# EAGLE schematic X16-Power-Slab (EAGLE 9.6.2)

## Sheet 1 of 2
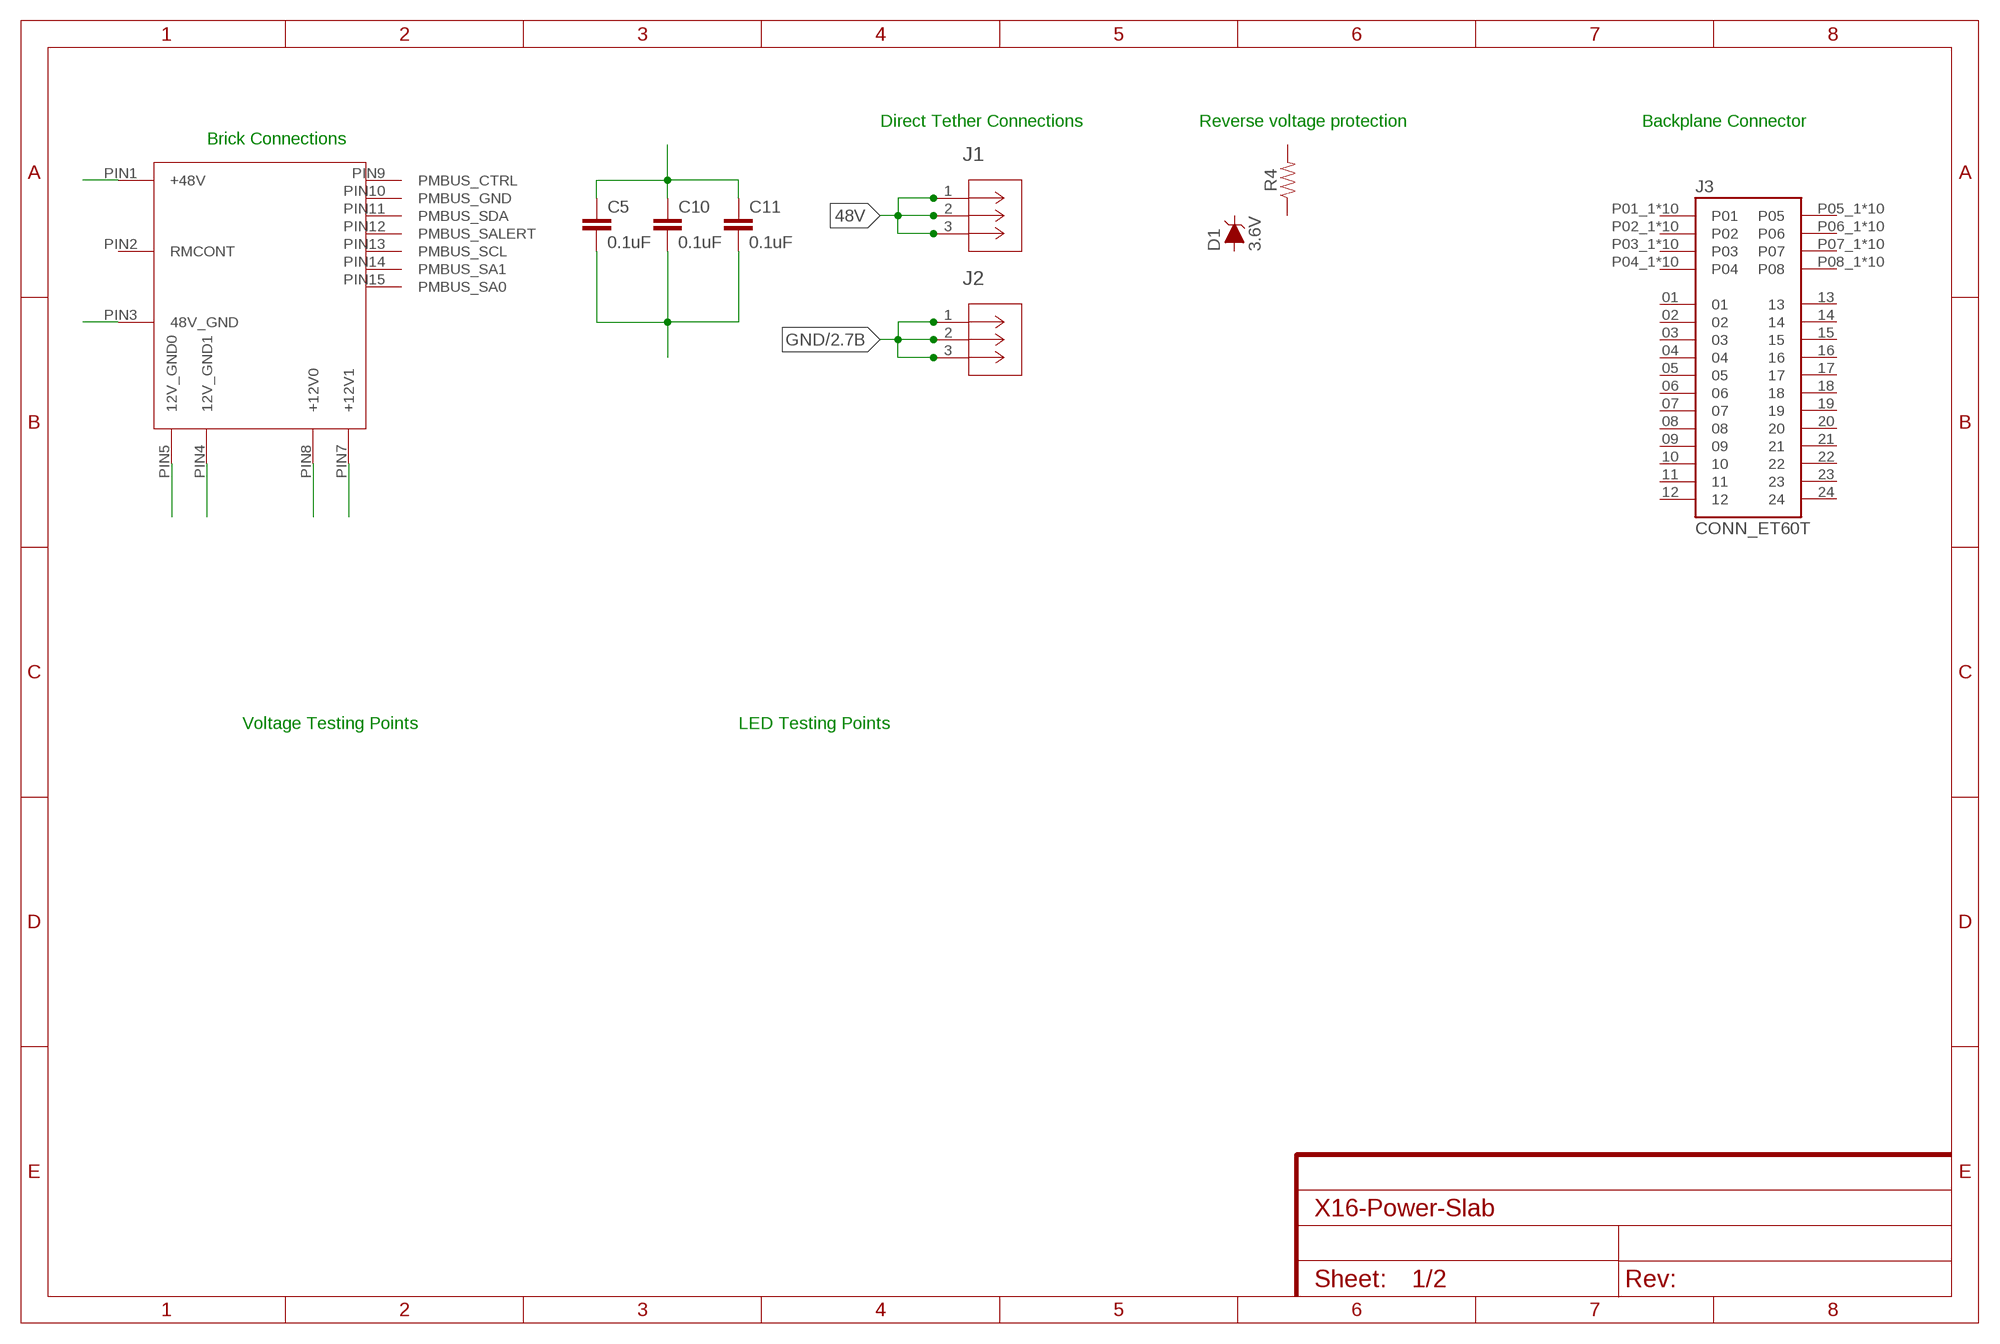
[diagram p0: schematic, sheet 1]

### Parts
C5  0.1uF  0.1UF-0603-25V-(+80/-20%)  [0603]
C10  0.1uF  0.1UF-0603-25V-(+80/-20%)  [0603]
C11  0.1uF  0.1UF-0603-25V-(+80/-20%)  [0603]
D1  3.6V  DIODE-ZENER-BZT52C3V6S  [SOD-323]
J1  CONN_796636-3  [CONN_796636-3]
J2  CONN_796636-3  [CONN_796636-3]
J3  CONN_ET60T  [SAMTEC_ET60T-D04-3-08-D04-X-R1-S]
R4  RESISTOR0603  [0603]
U$1  CONN_BMR480_BRICK  [CONN_BMR480_BRICK]

### Nets
48V: J1.1 J1.2 J1.3
GND: J2.1 J2.2 J2.3 ; also sheet 2
N$10: U$1.PIN5(12V_GND0)
N$11: U$1.PIN4(12V_GND1)
N$12: U$1.PIN8(+12V0)
N$13: U$1.PIN7(+12V1)
N$14: U$1.PIN3(48V_GND)
N$15: U$1.PIN1(+48V)
N$16: C5.1 C10.1 C11.1
N$17: C5.2 C10.2 C11.2
Unconnected: D1.A D1.C J3.01 J3.02 J3.03 J3.04 J3.05 J3.06 J3.07 J3.08 J3.09 J3.10 J3.11 J3.12 J3.13 J3.14 J3.15 J3.16 J3.17 J3.18 J3.19 J3.20 J3.21 J3.22 J3.23 J3.24 R4.1 R4.2 U$1.PIN2(RMCONT) U$1.PIN9(PMBUS_CTRL) U$1.PIN10(PMBUS_GND) U$1.PIN11(PMBUS_SDA) U$1.PIN12(PMBUS_SALERT) U$1.PIN13(PMBUS_SCL) U$1.PIN14(PMBUS_SA1) U$1.PIN15(PMBUS_SA0)

### Notes on the sheet
- Direct Tether Connections | Reverse voltage protection | Backplane Connector
- Brick Connections
- Voltage Testing Points | LED Testing Points

## Sheet 2 of 2
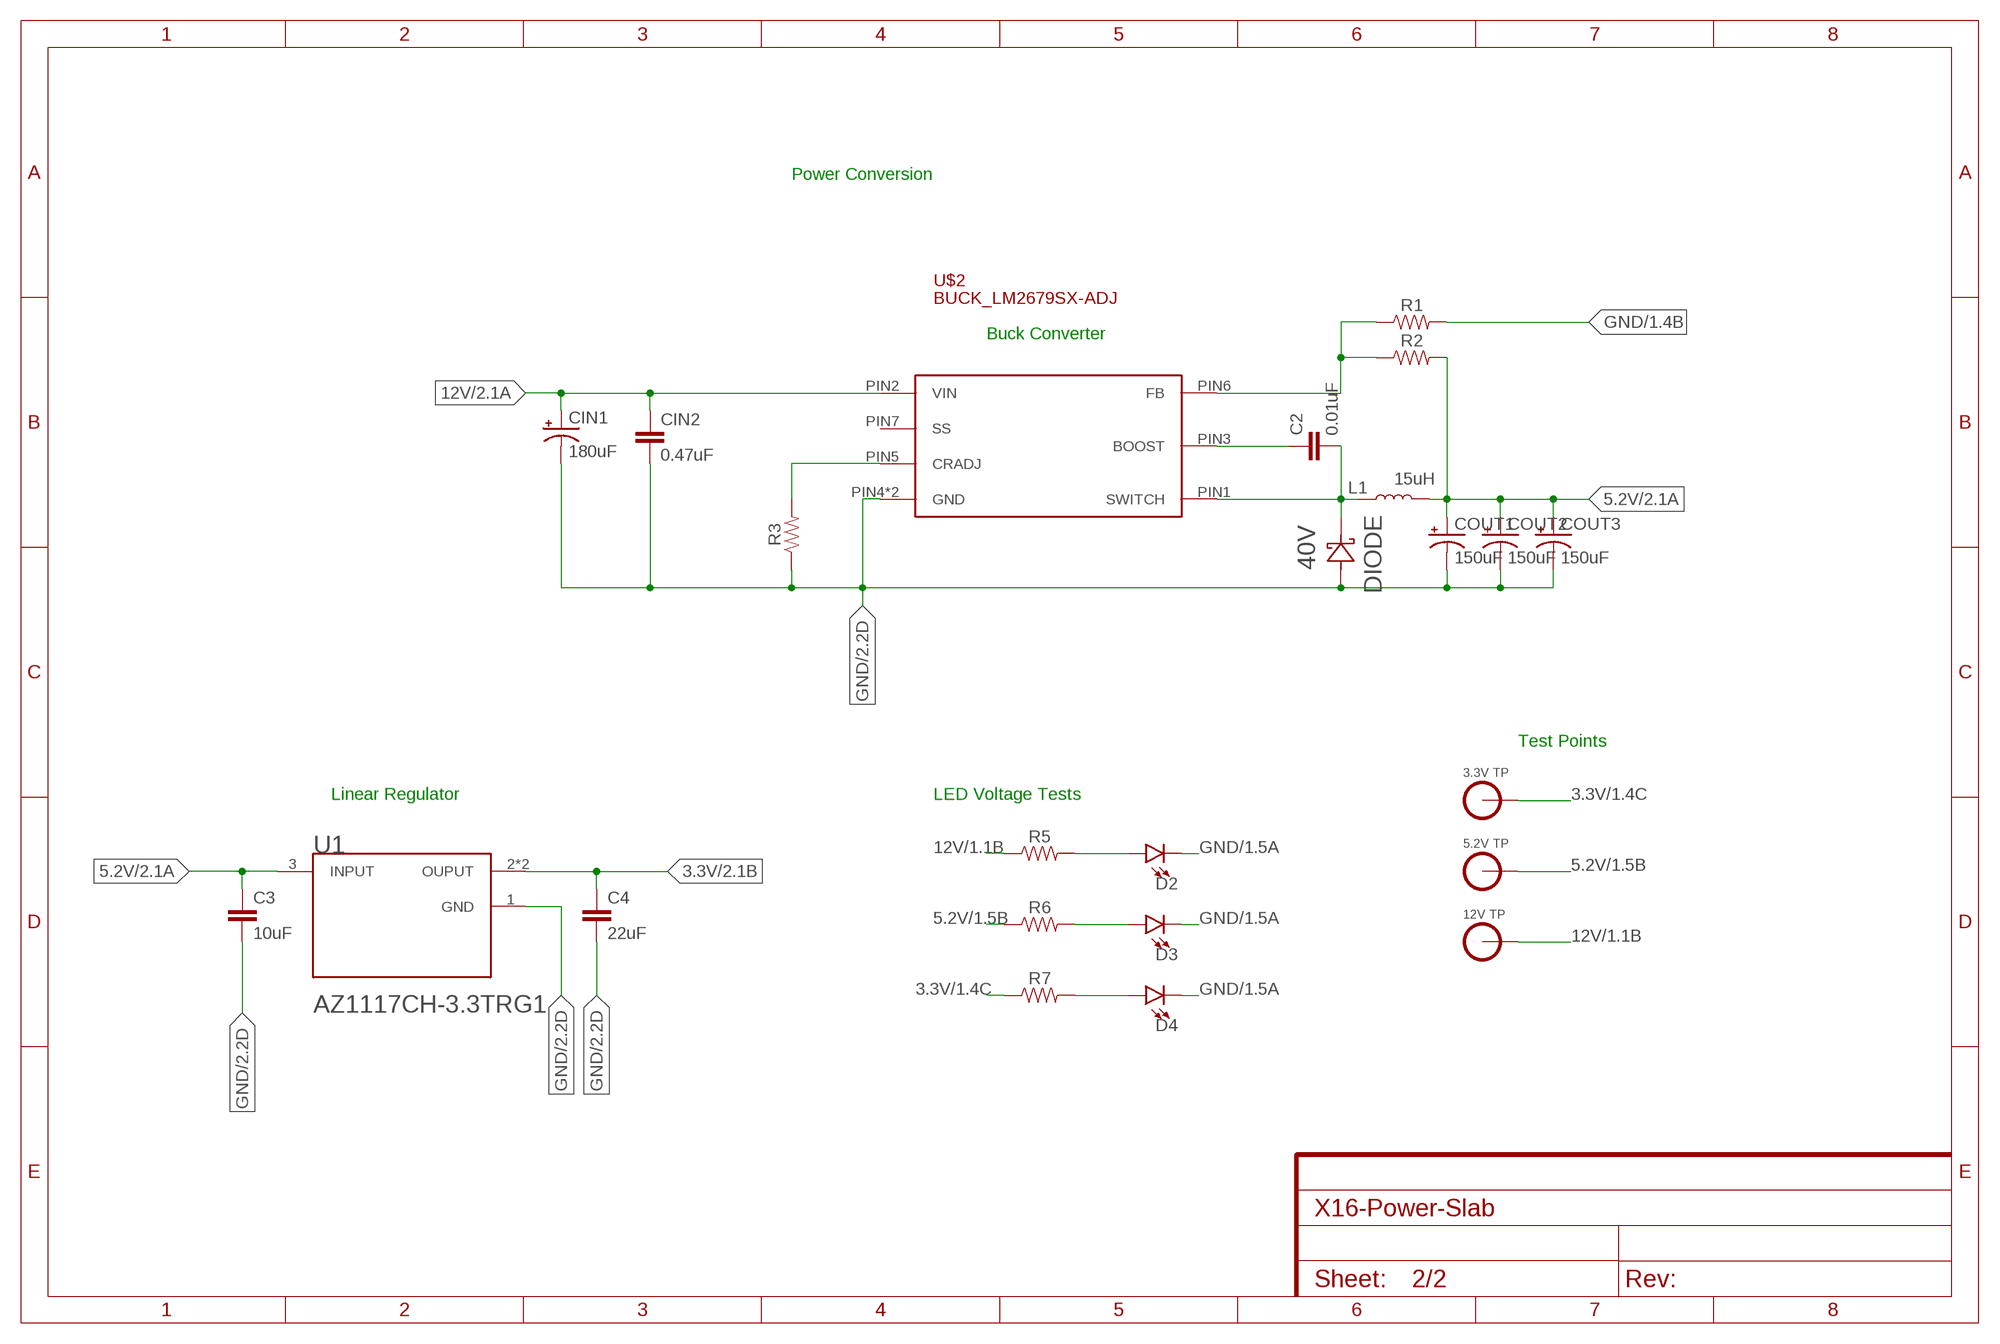
[diagram p1: schematic, sheet 2]

### Parts
C2  0.01uF  0.1UF-0603-25V-(+80/-20%)  [0603]
C3  10uF  0.1UF-0603-25V-(+80/-20%)  [0603]
C4  22uF  0.1UF-0603-25V-(+80/-20%)  [0603]
CIN1  180uF  10UF-POLAR-0603-6.3V-20%(TANT)  [0603-POLAR]
CIN2  0.47uF  0.1UF-0603-25V-(+80/-20%)  [0603]
COUT1  150uF  10UF-POLAR-0603-6.3V-20%(TANT)  [0603-POLAR]
COUT2  150uF  10UF-POLAR-0603-6.3V-20%(TANT)  [0603-POLAR]
COUT3  150uF  10UF-POLAR-0603-6.3V-20%(TANT)  [0603-POLAR]
D2  LED0603  [LED-0603]
D3  LED0603  [LED-0603]
D4  LED0603  [LED-0603]
DIODE  40V  CDBG520-G  [DO214AC]
L1  15uH  2.2μH_SHIELDED_INDUCTOR  [0806]
R1  RESISTOR0603  [0603]
R2  RESISTOR0603  [0603]
R3  RESISTOR0603  [0603]
R5  RESISTOR0603  [0603]
R6  RESISTOR0603  [0603]
R7  RESISTOR0603  [0603]
U1  LINEAR_AZ1117CR-3.3TRG1DIODES_AZ1117CH-3.3TRG1_0_0  [LINEAR_AZ1117CR-3.3TRG1]
U$2  BUCK_LM2679SX-ADJ  [BUCK,LM2679SX-ADJ]
U$3  3.3V_TESTPOINT  [3.3V_TESTPOINT]
U$4  5.2V_TESTPOINT  [5.2V_TESTPOINT]
U$5  12V_TESTPOINT  [12V_TESTPOINT]

### Nets
3.3V/1.4C: R7.1 U$3.3.3V
3.3V/2.1B: C4.1 U1.2(OUPUT) U1.4(OUPUT)
5.2V/1.5B: R6.1 U$4.5.2V
5.2V/2.1A: C3.1 COUT1.+ COUT2.+ COUT3.+ L1.2 R2.2 U1.3(INPUT)
12V/1.1B: R5.1 U$5.12V
12V/2.1A: CIN1.+ CIN2.1 U$2.PIN2(VIN)
GND: R1.2 ; also sheet 1
GND/1.5A: D2.C D3.C D4.C
GND/2.2D: C3.2 C4.2 CIN1.- CIN2.2 COUT1.- COUT2.- COUT3.- DIODE.A R3.1 U1.1(GND) U$2.PIN4(GND) U$2.PIN8(GND)
N$1: C2.1 U$2.PIN3(BOOST)
N$2: C2.2 DIODE.C L1.1 U$2.PIN1(SWITCH)
N$3: D2.A R5.2
N$4: R1.1 R2.1 U$2.PIN6(FB)
N$5: D3.A R6.2
N$6: D4.A R7.2
N$8: R3.2 U$2.PIN5(CRADJ)
Unconnected: U$2.PIN7(SS)

### Notes on the sheet
- Power Conversion
- Buck Converter
- Test Points
- Linear Regulator | LED Voltage Tests

## Power pins joined to a net without a drawn wire
P01: J3.P01_1(P01) J3.P01_2(P01) J3.P01_3(P01) J3.P01_4(P01) J3.P01_5(P01) J3.P01_6(P01) J3.P01_7(P01) J3.P01_8(P01) J3.P01_9(P01) J3.P01_10(P01)
P02: J3.P02_1(P02) J3.P02_2(P02) J3.P02_3(P02) J3.P02_4(P02) J3.P02_5(P02) J3.P02_6(P02) J3.P02_7(P02) J3.P02_8(P02) J3.P02_9(P02) J3.P02_10(P02)
P03: J3.P03_1(P03) J3.P03_2(P03) J3.P03_3(P03) J3.P03_4(P03) J3.P03_5(P03) J3.P03_6(P03) J3.P03_7(P03) J3.P03_8(P03) J3.P03_9(P03) J3.P03_10(P03)
P04: J3.P04_1(P04) J3.P04_2(P04) J3.P04_3(P04) J3.P04_4(P04) J3.P04_5(P04) J3.P04_6(P04) J3.P04_7(P04) J3.P04_8(P04) J3.P04_9(P04) J3.P04_10(P04)
P05: J3.P05_1(P05) J3.P05_2(P05) J3.P05_3(P05) J3.P05_4(P05) J3.P05_5(P05) J3.P05_6(P05) J3.P05_7(P05) J3.P05_8(P05) J3.P05_9(P05) J3.P05_10(P05)
P06: J3.P06_1(P06) J3.P06_2(P06) J3.P06_3(P06) J3.P06_4(P06) J3.P06_5(P06) J3.P06_6(P06) J3.P06_7(P06) J3.P06_8(P06) J3.P06_9(P06) J3.P06_10(P06)
P07: J3.P07_1(P07) J3.P07_2(P07) J3.P07_3(P07) J3.P07_4(P07) J3.P07_5(P07) J3.P07_6(P07) J3.P07_7(P07) J3.P07_8(P07) J3.P07_9(P07) J3.P07_10(P07)
P08: J3.P08_1(P08) J3.P08_2(P08) J3.P08_3(P08) J3.P08_4(P08) J3.P08_5(P08) J3.P08_6(P08) J3.P08_7(P08) J3.P08_8(P08) J3.P08_9(P08) J3.P08_10(P08)

## Library data of the parts
C2-C4 CIN2 = SparkFun-Capacitors:0.1UF: 0.1µF ceramic capacitors A capacitor is a passive two-terminal electrical component used to store electrical energy temporarily in an electric field.; PROD_ID: CAP-00810; VALUE: 0.1uF
C5 C10 C11 = SparkFun-Capacitors:0.1UF: 0.1µF ceramic capacitors A capacitor is a passive two-terminal electrical component used to store electrical energy temporarily in an electric field.; PROD_ID: CAP-00810
CIN1 COUT1-COUT3 = SparkFun-Capacitors:10UF-POLAR: 10.0µF polarized capacitors A capacitor is a passive two-terminal electrical component used to store electrical energy temporarily in an electric field.; PROD_ID: CAP-13210; VALUE: 10uF
D1 = SparkFun-DiscreteSemi:DIODE-ZENER: Zener Diode A Zener diode allows current to flow from its anode to its cathode like a normal semiconductor diode, but it also permits current to flow in the reverse direction when its "Zener voltage" is reached. - WIkipedia; PROD_ID: DIO-08199
D2-D4 = SparkFun-LED:LED: LED (Generic) Standard schematic elements and footprints for 5mm, 3mm, 1206, and 0603 sized LEDs. Generic LEDs with no color specified.
DIODE = X15-Conversion-Parts-Library:CDBG520-G
J1 J2 = X16_Power_Slab:CONN_796636-3: Phoenix Connector 796636-3: Connector for 48V to the power brick; COPYRIGHT: Copyright (C) 2022 Ultra Librarian. All rights reserved.; DIGI-KEY_PART_NUMBER_1: A98423-ND; MANUFACTURER_PART_NUMBER: 796636-3; MFR_NAME: TE Connectivity
J3 = X16_Power_Slab:CONN_ET60T: 32 Connector Header, Male Pins and Blades Through Hole, Right Angle Black EXTreme Ten60Power; MANUFACTURER: Samtec; MAXIMUM_PACKAGE_HEIGHT: 10.0 mm; PARTREV: J; STANDARD: Manufacturer Recommendations
L1 = SparkFun-Coils:2.2μH_SHIELDED_INDUCTOR: Murata 2.2uH Inductor 2.2uH 1.2A 110mOhm 0806 Package Shielded Bourns 2.2uH Inductor 2.2uH 5.5A 205mOhm 5x5mm Package Shielded; PROD_ID: NDUC-14257
R1-R7 = SparkFun-Resistors:RESISTOR: Generic Resistor Package
U1 = X16_Power_Slab:LINEAR_AZ1117CR-3.3TRG1: Linear Regulator: Convert 5V to 3.3V AZ1117CR-3.3TRG1: https://www.digikey.com/en/products/detail/diodes-incorporated/AZ1117CR-3-3TRG1/4470988?s=N4IgTCBcDaIIIC0CMKDsBhASgWgMwDpcAVTAcSRAF0BfIA; AVAILABILITY: In Stock; DESCRIPTION: Linear Voltage Regulator IC Positive Fixed 1 Output 1A SOT-223-3; MF: Diodes Inc.; MP: AZ1117CH-3.3TRG1; PACKAGE: SOT-223 Diodes Inc.; PRICE: None; PURCHASE-URL: https://pricing.snapeda.com/search/part/AZ1117CH-3.3TRG1/?ref=eda
U$1 = X16_Power_Slab:CONN_BMR480_BRICK
U$2 = X16_Power_Slab:BUCK_LM2679SX-ADJ
U$3 = X15-Conversion-Parts-Library:3.3V_TESTPOINT
U$4 = X15-Conversion-Parts-Library:5.2V_TESTPOINT
U$5 = X15-Conversion-Parts-Library:12V_TESTPOINT